# Altium schematic sheet bhl.SchDoc
size A4
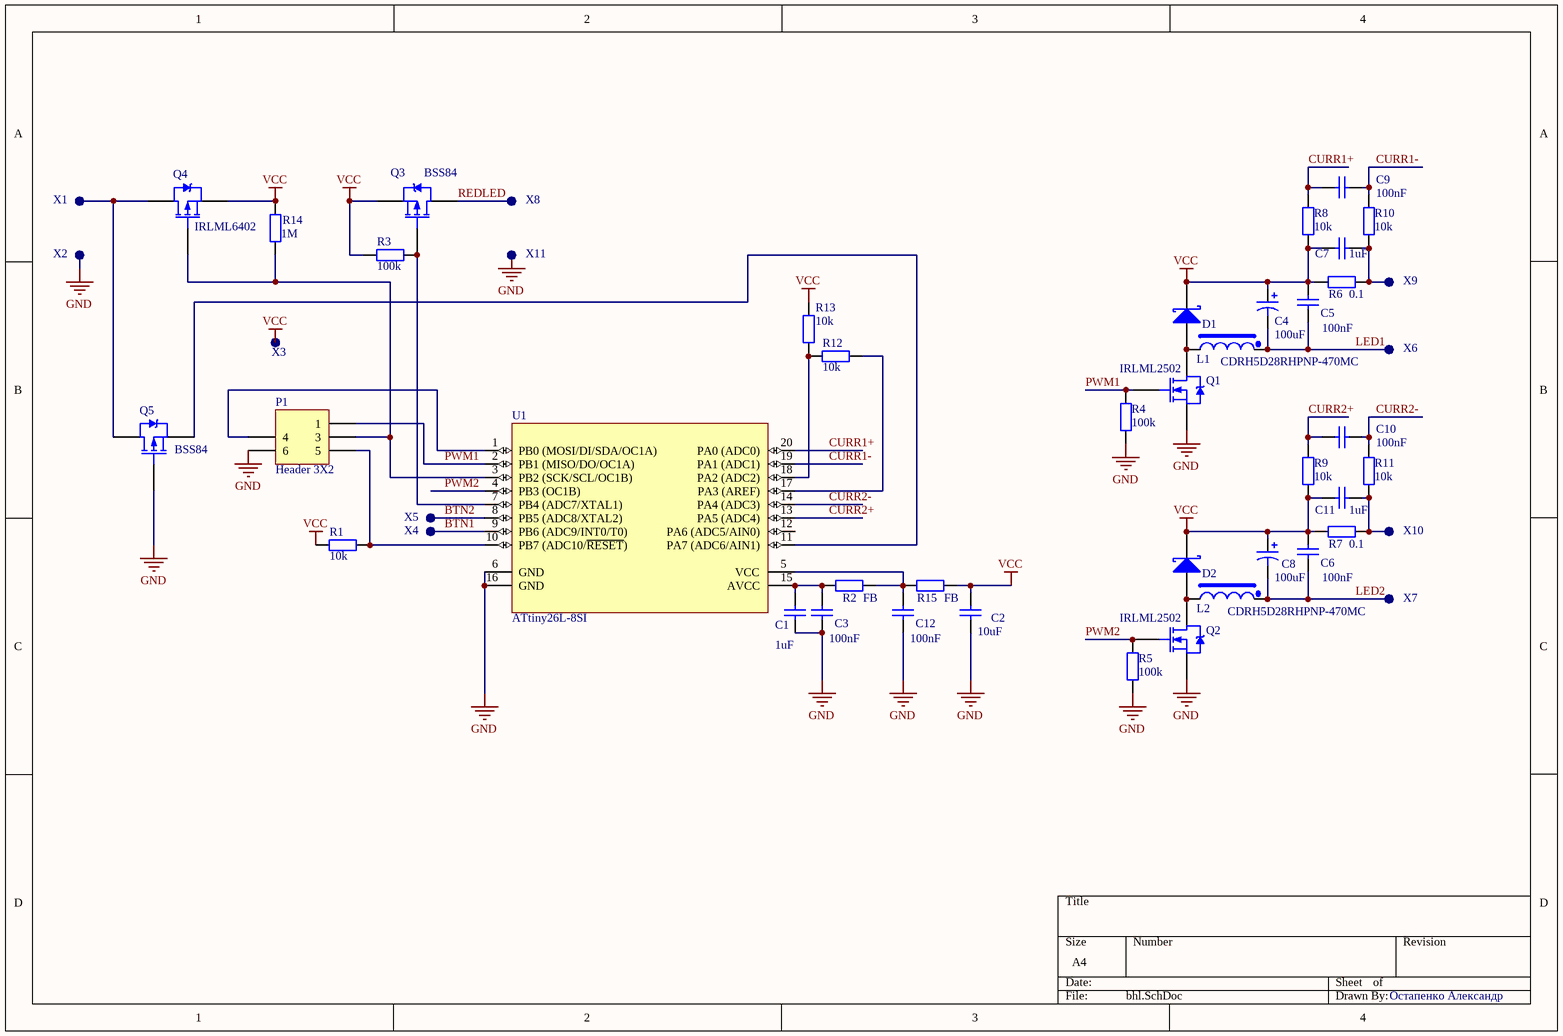
[diagram p0: bhl.SchDoc]

## Parts
C1  Номинал: 1uF  [CAPC2012N]  (hidden comment: C0805)
C2  Номинал: 10uF  [CAPC2012N]  (hidden comment: GRM21BR71A106KE51L)
C3  Номинал: 100nF  [CAPC1608N]  (hidden comment: C0603)
C4  Номинал: 100uF  [B]  (hidden comment: T491B)
C5  Номинал: 100nF  [CAPC1608N]  (hidden comment: C0603)
C6  Номинал: 100nF  [CAPC1608N]  (hidden comment: C0603)
C7  Номинал: 1uF  [CAPC2012N]  (hidden comment: C0805)
C8  Номинал: 100uF  [B]  (hidden comment: T491B)
C9  Номинал: 100nF  [CAPC1608N]  (hidden comment: C0603)
C10  Номинал: 100nF  [CAPC1608N]  (hidden comment: C0603)
C11  Номинал: 1uF  [CAPC2012N]  (hidden comment: C0805)
C12  Номинал: 100nF  [CAPC1608N]  (hidden comment: C0603)
D1  MBR0520  [DIODE]  (value not drawn)
D2  MBR0520  [DIODE]  (value not drawn)
L1  CDRH5D28RHPNP-470MC  [SMDPI]
L2  CDRH5D28RHPNP-470MC  [SMDPI]
P1  Header 3X2  [HDR2X3]  (no BOM)
Q1  IRLML2502  [SOT-23_N]
Q2  IRLML2502  [SOT-23_N]
Q3  BSS84  [SOT-23_N]
Q4  IRLML6402  [SOT-23_N]
Q5  BSS84  [SOT-23_N]
R1  Номинал: 10k  [RESC1608N]  (hidden comment: R0603)
R2  Номинал: FB  [RESC2012L]  (hidden comment: R_SMD_0805)
R3  Номинал: 100k  [RESC1608N]  (hidden comment: R0603)
R4  Номинал: 100k  [RESC1608N]  (hidden comment: R0603)
R5  Номинал: 100k  [RESC1608N]  (hidden comment: R0603)
R6  Номинал: 0.1  [RESC2012L]  (hidden comment: R_SMD_0805)
R7  Номинал: 0.1  [RESC2012L]  (hidden comment: R_SMD_0805)
R8  Номинал: 10k  [RESC1608N]  (hidden comment: R0603)
R9  Номинал: 10k  [RESC1608N]  (hidden comment: R0603)
R10  Номинал: 10k  [RESC1608N]  (hidden comment: R0603)
R11  Номинал: 10k  [RESC1608N]  (hidden comment: R0603)
R12  Номинал: 10k  [RESC1608N]  (hidden comment: R0603)
R13  Номинал: 10k  [RESC1608N]  (hidden comment: R0603)
R14  Номинал: 1M  [RESC1608N]  (hidden comment: R0603)
R15  Номинал: FB  [RESC2012L]  (hidden comment: R_SMD_0805)
U1  ATtiny26L-8SI  [20S_N]
X1  DOT_1.5  [PAD_2x0.4]  (value not drawn)  (no BOM)
X2  DOT_1.5  [PAD_2x0.4]  (value not drawn)  (no BOM)
X3  TP  [TP]  (value not drawn)
X4  DOT_1.5  [PAD_2x0.4]  (value not drawn)  (no BOM)
X5  DOT_1.5  [PAD_2x0.4]  (value not drawn)  (no BOM)
X6  DOT_1.5  [PAD_2x0.4]  (value not drawn)  (no BOM)
X7  DOT_1.5  [PAD_2x0.4]  (value not drawn)  (no BOM)
X8  DOT_1.5  [PAD_2x0.4]  (value not drawn)  (no BOM)
X9  DOT_1.5  [PAD_2x0.4]  (value not drawn)  (no BOM)
X10  DOT_1.5  [PAD_2x0.4]  (value not drawn)  (no BOM)
X11  DOT_1.5  [PAD_2x0.4]  (value not drawn)  (no BOM)

## Nets
GND: C1.1 C2.1 C3.1 C12.1 P1.6 Q1.2(S) Q2.2(S) Q5.1(G) R4.1 R5.1 U1.6(GND) U1.16(GND) X2.1 X11.1
VCC: C2.2 C4.1 C5.2 C6.2 C7.1 C8.1 C11.1 D1.2(K) D2.2(K) Q3.2(S) Q4.2(S) R1.1 R3.1 R6.2 R7.2 R8.2 R9.2 R13.2 R14.1 R15.1 X3.1
BTN1: U1.9(PB6_(ADC9/INT0/T0)) X4.1
BTN2: U1.8(PB5_(ADC8/XTAL2)) X5.1
CURR1+: C9.2 R8.1 U1.20(PA0_(ADC0))
CURR1-: C9.1 R10.1 U1.19(PA1_(ADC1))
CURR2+: C10.2 R9.1 U1.13(PA5_(ADC4))
CURR2-: C10.1 R11.2 U1.14(PA4_(ADC3))
LED1: C4.2 C5.1 L1.2 X6.1
LED2: C6.1 C8.2 L2.2 X7.1
PWM1: P1.1 Q1.1(G) R4.2 U1.2(PB1_(MISO/DO/OC1A))
PWM2: Q2.1(G) R5.2 U1.4(PB3_(OC1B))
REDLED: Q3.3(D) X8.1
NetC1_2: C1.2 C3.2 R2.2 U1.15(AVCC)
NetC7_2: C7.2 R6.1 R10.2 X9.1
NetC11_2: C11.2 R7.1 R11.1 X10.1
NetC12_2: C12.2 R2.1 R15.2 U1.5(VCC)
NetD1_1: D1.1(A) L1.1 Q1.3(D)
NetD2_1: D2.1(A) L2.1 Q2.3(D)
NetP1_3: P1.3 Q4.1(G) R14.2 U1.3(PB2_(SCK/SCL/OC1B))
NetP1_4: P1.4 U1.1(PB0_(MOSI/DI/SDA/OC1A))
NetP1_5: P1.5 R1.2 U1.10(PB7_(ADC10/~{RESET}))
NetQ3_1: Q3.1(G) R3.2 U1.7(PB4_(ADC7/XTAL1))
NetQ4_3: Q4.3(D) Q5.3(D) X1.1
NetQ5_2: Q5.2(S) U1.11(PA7_(ADC6/AIN1))
NetR12_1: R12.1 R13.1 U1.18(PA2_(ADC2))
NetR12_2: R12.2 U1.17(PA3_(AREF))

Not connected (* = marked no-connect by the designer): U1 12(PA6_(ADC5/AIN0))

## Notes on the sheet
- Остапенко Александр

## Library data of the parts
C1 C2 C7 C11 = C0805: Ceramic Chip Capacitor - Standard; Note: Footprint corresponds to dimensions for bulk cassette packaging. This case size has tightened tolerances.; Published: 17-Jul-2002; LatestRevisionDate: 19-Mar-2004; LatestRevisionNote: Silkscreen size reduced.; DatasheetDocument: Mar-2001; PackageDocument: Mar-2001; PackageReference: 0805; Publisher: Altium Limited; Code_JEITA: 0805; Code_IPC: 2012[0805]; ComponentLink1Description: Manufacturer Link; ComponentLink1URL: http://www.kemet.com/; ComponentLink2Description: Datasheet; ComponentLink2URL: http://www.kemet.com/kemet/web/homepage/kechome.nsf/vapubfilesname/F3102TA.pdf/$file/F3102TA.pdf
C3 C5 C6 C9 C10 C12 = C0603: Конденсатор; Корпус: 0805
C4 C8 = T491B: Solid Tantalum Chip Capacitor, Standard T491 Series - Industrial Grade; Published: 17-Jul-2002; LatestRevisionDate: 19-Mar-2004; LatestRevisionNote: Silkscreen dimensions re-sized.; DatasheetDocument: Mar-2001; PackageDocument: Mar-2001; PackageReference: B; Publisher: Altium Limited; Code_JEITA: 3528-21; ComponentLink1Description: Manufacturer Link; ComponentLink1URL: http://www.kemet.com/; ComponentLink2Description: Datasheet; ComponentLink2URL: http://www.kemet.com/kemet/web/homepage/kechome.nsf/vapubfilesname/F3102TA.pdf/$file/F3102TA.pdf
D1 D2 = MBR0520: Schottky Rectifier; Published: 8-Jun-2000; LatestRevisionDate: 17-Jul-2002; LatestRevisionNote: Re-released for DXP Platform.; DatasheetDocument: Dec-1997; PackageReference: D-64; Publisher: Altium Limited; ComponentLink1Description: Manufacturer Link; ComponentLink1URL: http://www.irf.com/; ComponentLink2Description: Datasheet; ComponentLink2URL: http://www.irf.com/product-info/datasheets/data/10mq040n.pdf
L1 L2 = L: Дроссель высокочастотный; Тип: *; Индуктивность: *; Ток подмагничивания: *
P1 = Header 3X2: Header, 3-Pin, Dual row; LatestRevisionDate: 17-Jul-2002; LatestRevisionNote: Re-released for DXP Platform.; Publisher: Altium Limited
Q1 Q2 = IRLML2402: HEXFET Power MOSFET; Published: 8-Jun-2000; LatestRevisionDate: 20-Nov-2009; LatestRevisionNote: IPC-7351 Footprint Added.; DatasheetVersion: Aug-1997; PackageReference: SOT-23; Publisher: Altium Limited; PackageDescription: 3-Pin SOT-23 Package 0.95 mm Pitch, 2.3 mm Lead Span; ComponentLink1Description: Manufacturer Link; ComponentLink1URL: http://www.irf.com/; ComponentLink2Description: Datasheet; ComponentLink2URL: http://www.irf.com/product-info/datasheets/data/irlml2402.pdf
Q3-Q5 = IRLML6302: HEXFET Power MOSFET; Published: 8-Jun-2000; LatestRevisionDate: 20-Nov-2009; LatestRevisionNote: IPC-7351 Footprint Added.; DatasheetVersion: Aug-1997; PackageReference: SOT-23; Publisher: Altium Limited; PackageDescription: 3-Pin SOT-23 Package 0.95 mm Pitch, 2.3 mm Lead Span; ComponentLink1Description: Manufacturer Link; ComponentLink1URL: http://www.irf.com/; ComponentLink2Description: Datasheet; ComponentLink2URL: http://www.irf.com/product-info/datasheets/data/irlml6302.pdf
R1 R3-R5 R8-R14 = R0603: Резистор; Корпус: 0805
R2 R6 R7 R15 = R_SMD_0805: Резистор; Допуск: +-5%; Корпус: 0805
U1 = ATtiny26L-8SI: 8-Bit AVR Microcontroller with 2K Bytes of Flash Memory; Published: 17-Sep-2003; LatestRevisionDate: 13-Apr-2006; LatestRevisionNote: IPC-7351 Footprint Added.; DatasheetVersion: 1477C-AVR-09/02; PackageVersion: Aug-1999; PackageReference: 20S; Publisher: Altium Limited; PackageDescription: 20-Pin Small Outline Integrated Circuit 1.27 mm Pitch; ComponentLink1Description: Manufacturer Link; ComponentLink1URL: http://www.atmel.com; ComponentLink2Description: Datasheet; ComponentLink2URL: http://www.atmel.com/dyn/resources/prod_documents/doc1477.pdf
X1 X2 X4-X11 = DOT_1.5: Разем
X3 = TP: Test Point